# Altium schematic sheet BSPD.SchDoc
size A4
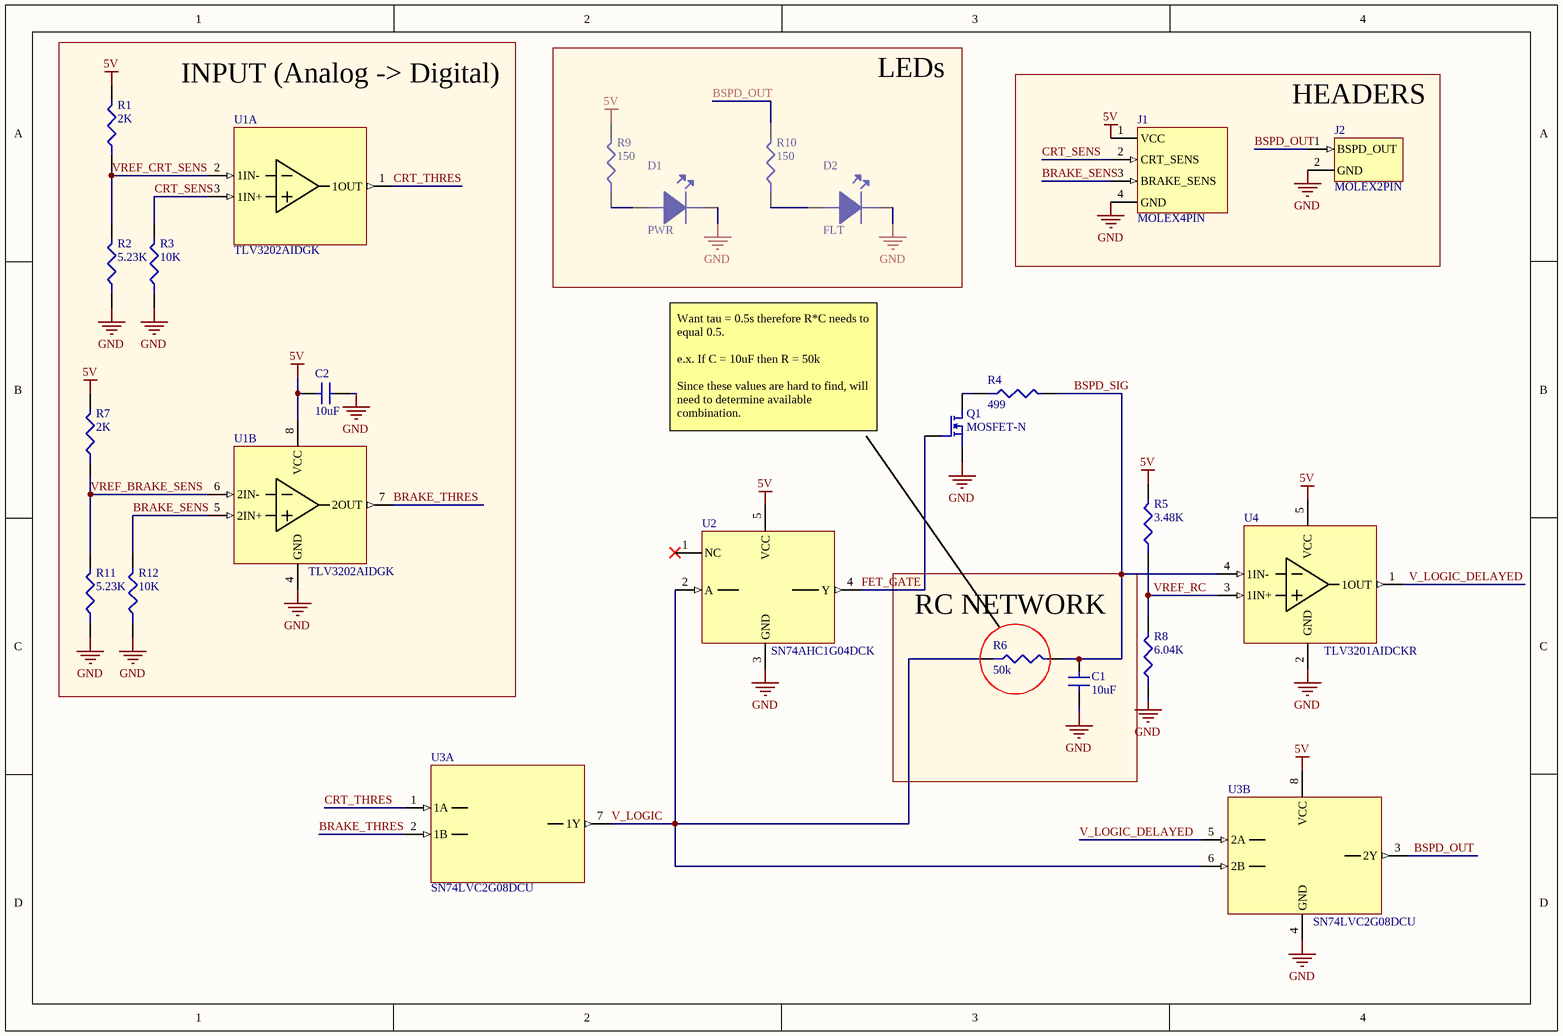
[diagram p0: BSPD.SchDoc]

## Parts
C1  10uF  [C0805]
C2  10uF  [C0805]
D1  PWR  [LED_0603]
D2  FLT  [LED_0603]
J1  MOLEX4PIN  [MOLEX_4PIN]
J2  MOLEX2PIN  [MOLEX_2PIN]
Q1  MOSFET-N  [MOSFET]
R1  2K  [R0805]
R2  5.23K  [R0805]
R3  10K  [R0805]
R4  499  [R0805]
R5  3.48K  [R0805]
R6  50k  [RESC2013X12N]
R7  2K  [R0805]
R8  6.04K  [R0805]
R9  150  [RESC2012X07N]
R10  150  [RESC2012X07N]
R11  5.23K  [R0805]
R12  10K  [R0805]
U1  TLV3202AIDGK  [TLV3202AIDGK]  (parts A,B of 2)
U2  SN74AHC1G04DCK  [SN74AHC1G04DCK]
U3  SN74LVC2G08DCU  [SN74LVC2G08DCUR]  (parts A,B of 2)
U4  TLV3201AIDCKR  [TLV3201AIDCK]

## Blocks framed on the sheet
INPUT (Analog -> Digital): C2 R1-R3 R7 R11 R12 U1
LEDs: D1 D2 R9 R10
HEADERS: J1 J2
RC NETWORK: C1 R6

## Nets
5V: C2.2 J1.1(VCC) R1.2 R5.2 R7.2 R9.2 U1.8(VCC) U2.5(VCC) U3.8(VCC) U4.5(VCC)
GND: C1.1 C2.1 D1.2 D2.2 J1.4(GND) J2.2(GND) Q1.2 R2.1 R3.1 R8.1 R11.1 R12.1 U1.4(GND) U2.3(GND) U3.4(GND) U4.2(GND)
BRAKE_SENS: J1.3(BRAKE_SENS) R12.2 U1.5(2IN+)
BRAKE_THRES: U1.7(2OUT) U3.2(1B)
BSPD_OUT: J2.1(BSPD_OUT) R10.2 U3.3(2Y)
BSPD_SIG: C1.2 R4.2 R6.2 U4.4(1IN-)
CRT_SENS: J1.2(CRT_SENS) R3.2 U1.3(1IN+)
CRT_THRES: U1.1(1OUT) U3.1(1A)
FET_GATE: Q1.1 U2.4(Y)
V_LOGIC: R6.1 U2.2(A) U3.6(2B) U3.7(1Y)
V_LOGIC_DELAYED: U3.5(2A) U4.1(1OUT)
VREF_BRAKE_SENS: R7.1 R11.2 U1.6(2IN-)
VREF_CRT_SENS: R1.1 R2.2 U1.2(1IN-)
VREF_RC: R5.1 R8.2 U4.3(1IN+)
NetD1_1: D1.1 R9.1
NetD2_1: D2.1 R10.1
NetQ1_3: Q1.3 R4.1

Not connected (* = marked no-connect by the designer): U2 1(NC)*

## Notes on the sheet
- Want tau = 0.5s therefore R*C needs to equal 0.5.
  e.x. If C = 10uF then R = 50k
  Since these values are hard to find, will need to determine available combination.

## Library data of the parts
C1 C2 = CL21A106KPFNNNG: Cap Ceramic 10uF 10V X5R 10% SMD 0805 85C Embossed T/R; Manufacturer: Samsung; Supplier 1: Digi-Key; Manufacturer Part Number: CL21A106KPFNNNG; Stock 1: 0; Pricing 1: 1=0.15, 10=0.104, 100=0.0489, 500=0.03428, 1000=0.02837 (USD); Mount: Surface Mount; Case/Package: 0805; Case Code (Metric): 2012; Case Code (Imperial): 0805; Min Operating Temperature: -55°C; Max Operating Temperature: 85°C; Capacitance: 10uF; Tolerance: 10%; Dielectric: X5R; Voltage: 10V; Voltage Rating: 10V; Packaging: Tape and Reel; Package Quantity: 3000; Termination: Wraparound; Length: 2mm; Height: 1.25mm; Depth: 1.25mm; Width: 0.049inch; Thickness: 0.053inch; Radiation Hardening: No; Lead Free: Lead Free; ComponentLink1URL: http://www1.futureelectronics.com/doc/SAMSUNG/CL21A106KPFNNNG.pdf?src-supplier=Future+Electronics; ComponentLink1Description: http://www1.futureelectronics.com/doc/SAMSUNG/CL21A106KPFNNNG.pdf?src-supplier=Future+Electronics; ComponentLink2URL: https://www.verical.com/server-webapp/html/getDatasheet?partID=640497&src-supplier=Verical; ComponentLink2Description: https://www.verical.com/server-webapp/html/getDatasheet?partID=640497&src-supplier=Verical; Supplier Part Number 1: 1276-6456-1-ND
D1 = LTST-C191KGKT: LED GREEN CLEAR SMD; Manufacturer: Vishay Lite-On; Lens Color: Colorless; Power Rating: 75mW; Luminous Intensity: 35mcd; Viewing Angle: 130°; Lens Style: Diffused,Colorless,Rectangular,Clear; Forward Current: 30mA; Forward Voltage: 2V; Dominant Wavelength: 571nm; Test Current: 20mA; Number of Elements: 1; Wavelength: 574nm; Reverse Voltage: 5V; Supplier 1: Digi-Key; Manufacturer Part Number: LTST-C191KGKT; Stock 1: 1356717; Pricing 1: 1=0.29, 10=0.211, 25=0.1556, 100=0.1111, 250=0.07556, 500=0.06666, 1000=0.05222, 2500=0.05111 (USD); Mount: Surface Mount; Case/Package: 0603; Number of Pins: 2; Color: Green; Case Code (Metric): 1608; Case Code (Imperial): 0603; Min Operating Temperature: -55°C; Max Operating Temperature: 85°C; Packaging: Tape and Reel; Package Quantity: 1; Illumination Color: Green; Lens Transparency: Clear; Power Dissipation: 75mW; Number of LEDs: 1; Length: 1.6mm; Height: 0.55mm; Width: 0.8mm; Depth: 0.8mm; Radiation Hardening: No; Lead Free: Lead Free; ComponentLink1URL: http://www.mouser.com/ds/2/239/LTST-C191KGKT-1141954.pdf?src-supplier=Mouser; ComponentLink1Description: http://www.mouser.com/ds/2/239/LTST-C191KGKT-1141954.pdf?src-supplier=Mouser; ComponentLink2URL: http://optoelectronics.liteon.com/upload/download/DS22-2000-228/LTST-C191KGKT.PDF?src-supplier=Digi-Key; ComponentLink2Description: http://optoelectronics.liteon.com/upload/download/DS22-2000-228/LTST-C191KGKT.PDF?src-supplier=Digi-Key; ComponentLink3URL: https://www.verical.com/server-webapp/html/getDatasheet?partID=103913&src-supplier=Verical; ComponentLink3Description: https://www.verical.com/server-webapp/html/getDatasheet?partID=103913&src-supplier=Verical; ComponentLink4URL: http://uk.rs-online.com/webdocs/0dc0/0900766b80dc02b1.pdf?src-supplier=RSComponents; ComponentLink4Description: http://uk.rs-online.com/webdocs/0dc0/0900766b80dc02b1.pdf?src-supplier=RSComponents; ComponentLink5URL: http://www1.futureelectronics.com/doc/LITE-ON/LTST-C191KGKT.pdf?src-supplier=Future+Electronics; ComponentLink5Description: http://www1.futureelectronics.com/doc/LITE-ON/LTST-C191KGKT.pdf?src-supplier=Future+Electronics; Supplier Part Number 1: 160-1446-1-ND
D2 = LTST-C191KRKT: LED RED CLEAR SMD; Manufacturer: Vishay Lite-On; Lens Color: Colorless; Power Rating: 75mW; Luminous Intensity: 54mcd; Viewing Angle: 130°; Forward Voltage: 2V; Lens Style: Clear,Diffused,Colorless,Rectangular; Forward Current: 30mA; Dominant Wavelength: 631nm; Test Current: 20mA; Number of Elements: 1; Wavelength: 639nm; Reverse Voltage: 5V; Supplier 1: Digi-Key; Manufacturer Part Number: LTST-C191KRKT; Stock 1: 1012880; Pricing 1: 1=0.29, 10=0.211, 25=0.1556, 100=0.1111, 250=0.07556, 500=0.06666, 1000=0.05222, 2500=0.05111 (USD); Mount: Surface Mount; Case/Package: 0603; Number of Pins: 2; Color: Red; Case Code (Metric): 1608; Case Code (Imperial): 0603; Min Operating Temperature: -55°C; Max Operating Temperature: 85°C; Packaging: Tape and Reel; Package Quantity: 1; Illumination Color: Red; Lens Transparency: Clear; Power Dissipation: 75mW; Number of LEDs: 1; Voltage: 2V; Length: 1.6mm; Height: 0.55mm; Width: 0.8mm; Depth: 0.8mm; Radiation Hardening: No; Lead Free: Lead Free; ComponentLink1URL: http://optoelectronics.liteon.com/upload/download/DS22-2000-223/LTST-C191KRKT.PDF?src-supplier=Digi-Key; ComponentLink1Description: http://optoelectronics.liteon.com/upload/download/DS22-2000-223/LTST-C191KRKT.PDF?src-supplier=Digi-Key; ComponentLink2URL: http://www1.futureelectronics.com/doc/LITE-ON/LTST-C191KRKT.pdf?src-supplier=Future+Electronics; ComponentLink2Description: http://www1.futureelectronics.com/doc/LITE-ON/LTST-C191KRKT.pdf?src-supplier=Future+Electronics; ComponentLink3URL: https://www.verical.com/server-webapp/html/getDatasheet?partID=141922&src-supplier=Verical; ComponentLink3Description: https://www.verical.com/server-webapp/html/getDatasheet?partID=141922&src-supplier=Verical; ComponentLink4URL: http://www.mouser.com/ds/2/239/LTST-C191KRKT-1140668.pdf?src-supplier=Mouser; ComponentLink4Description: http://www.mouser.com/ds/2/239/LTST-C191KRKT-1140668.pdf?src-supplier=Mouser; Supplier Part Number 1: 160-1447-1-ND
J1 = 43650-0400: MOLEX         43650-0400             Wire-To-Board Connector, Micro-Fit 3.0 43650 Series, Solder, Header, 4 Contacts, 3 mm; Connector Type: Plug,Socket; Number of Positions: 4; Current Rating: 5A; Voltage Rating: 600V; Contact Resistance: 10mR; Gender: Male; Voltage Rating (DC): 250V; Pitch: 3mm; Glow Wire Compliant: Compliant; Supplier 1: Digi-Key; Manufacturer: Molex; Manufacturer Part Number: 43650-0400; Stock 1: 1256; Pricing 1: 1=1.36, 10=1.23, 100=1.054, 500=0.87832, 2380=0.72776, 7140=0.66753, 11900=0.65247 (USD); Mount: Cable,Through Hole; Contact Material: Brass,Copper Alloy; Contact Plating: Bright,Tin; Colour: Black; Housing Material: Thermoplastic; Housing Colour: Black; Min Operating Temperature: -40°C; Max Operating Temperature: 105°C; Number of Rows: 1; Packaging: Tray; Termination: Solder; Number of Contacts: 4; Orientation: Right Angle; Package Quantity: 2380; Max Voltage Rating (AC): 600V; Number of Circuits: 4; Length: 14.86mm; Height: 4.5mm; Depth: 3.6mm; Radiation Hardening: No; REACH SVHC: Unknown; Halogen Free: Low Halogen; Lead Free: Contains Lead; Flammability Rating: UL94 V-0; ComponentLink1URL: http://uk.rs-online.com/webdocs/1362/0900766b81362fcc.pdf; ComponentLink1Description: http://uk.rs-online.com/webdocs/1362/0900766b81362fcc.pdf; ComponentLink2URL: http://www.molex.com/webdocs/datasheets/pdf/en-us/0436500400_PCB_HEADERS.pdf; ComponentLink2Description: http://www.molex.com/webdocs/datasheets/pdf/en-us/0436500400_PCB_HEADERS.pdf; ComponentLink3URL: https://www.alliedelec.com/m/d/479cb0864148560b2cdf92342e899bdb.pdf; ComponentLink3Description: https://www.alliedelec.com/m/d/479cb0864148560b2cdf92342e899bdb.pdf; ComponentLink4URL: http://www.onlinecomponents.com/productFiles/mf-MOL/0436500400_pcb_headers.pdf; ComponentLink4Description: http://www.onlinecomponents.com/productFiles/mf-MOL/0436500400_pcb_headers.pdf; ComponentLink5URL: http://www.mouser.com/ds/2/276/0436500400_PCB_HEADERS-148663.pdf; ComponentLink5Description: http://www.mouser.com/ds/2/276/0436500400_PCB_HEADERS-148663.pdf; ComponentLink6URL: http://www.jameco.com/Jameco/Products/ProdDS/884184.pdf; ComponentLink6Description: http://www.jameco.com/Jameco/Products/ProdDS/884184.pdf; Supplier Part Number 1: WM1862-ND
J2 = 43650-0200: Headers & Wire Housings R/A HEADER 2 POS TIN SINGLE ROW; Manufacturer: Molex; Contact Resistance: 10mR; Number of Positions: 2; Connector Type: Plug,Socket; Current Rating: 5A; Voltage Rating (AC): 250V; Voltage Rating: 600V; Gender: Male; Insulation Resistance: 1GR; Pitch: 3mm; Glow Wire Compliant: Compliant; Supplier 1: Digi-Key; Manufacturer Part Number: 43650-0200; Stock 1: 33161; Pricing 1: 1=0.96, 10=0.841, 100=0.7256, 500=0.59364, 3927=0.47821, 7854=0.46172, 11781=0.43863 (USD); Mount: Through Hole; Contact Plating: Tin; Contact Material: Brass,Tin; Colour: Black; Housing Colour: Black; Housing Material: Thermoplastic; Min Operating Temperature: -40°C; Max Operating Temperature: 105°C; Number of Rows: 1; Packaging: Tray; Termination: Solder; Number of Contacts: 2; Orientation: Right Angle; Package Quantity: 3927; Working Voltage: 250V; Number of Circuits: 2; Voltage Rating (DC): 250V; Length: 9.65mm; Height: 5.57mm; Depth: 9.9mm; Radiation Hardening: No; Flammability Rating: UL94 V-0; REACH SVHC: Unknown; Halogen Free: Low Halogen; Lead Free: Lead Free; ComponentLink1URL: http://www.molex.com/webdocs/datasheets/pdf/en-us/0436500200_PCB_HEADERS.pdf; ComponentLink1Description: http://www.molex.com/webdocs/datasheets/pdf/en-us/0436500200_PCB_HEADERS.pdf; ComponentLink2URL: http://www.onlinecomponents.com/productFiles/mf-MOL/1029720436500200_pcb_headers.pdf; ComponentLink2Description: http://www.onlinecomponents.com/productFiles/mf-MOL/1029720436500200_pcb_headers.pdf; ComponentLink3URL: http://www.farnell.com/datasheets/1933359.pdf; ComponentLink3Description: http://www.farnell.com/datasheets/1933359.pdf; ComponentLink4URL: https://www.distrelec.biz/Web/Downloads/20/66/04402066.pdf?mime=application%2Fpdf; ComponentLink4Description: https://www.distrelec.biz/Web/Downloads/20/66/04402066.pdf?mime=application%2Fpdf; ComponentLink5URL: http://www.jameco.com/Jameco/Products/ProdDS/884053.pdf; ComponentLink5Description: http://www.jameco.com/Jameco/Products/ProdDS/884053.pdf; ComponentLink6URL: http://www.mouser.com/ds/2/276/0436500200_PCB_HEADERS-148844.pdf; ComponentLink6Description: http://www.mouser.com/ds/2/276/0436500200_PCB_HEADERS-148844.pdf; ComponentLink7URL: http://uk.rs-online.com/webdocs/13c3/0900766b813c3b7d.pdf; ComponentLink7Description: http://uk.rs-online.com/webdocs/13c3/0900766b813c3b7d.pdf; ComponentLink8URL: http://www.farnell.com/datasheets/1709823.pdf; ComponentLink8Description: http://www.farnell.com/datasheets/1709823.pdf; Supplier Part Number 1: WM1860-ND
Q1 = BSS138LT3G: MOSFET N-CH 50V 200MA SOT-23; Manufacturer: ON Semiconductor; Nominal Vgs: 500mV; Input Capacitance: 50pF; Number of Elements: 1; Max Power Dissipation: 225mW; Rds On Max: 3.5R; Turn-Off Delay Time: 20ns; Element Configuration: Single; Gate to Source Voltage (Vgs): 20V; Supplier 1: Digi-Key; Manufacturer Part Number: BSS138LT3G; Stock 1: 195647; Pricing 1: 1=0.45, 10=0.408, 100=0.2284, 500=0.12234, 1000=0.0832 (USD); Case/Package: SOT-23-3; Number of Pins: 3; Min Operating Temperature: -55°C; Max Operating Temperature: 150°C; Package Quantity: 1; Packaging: Tape and Reel; Drain to Source Voltage (Vdss): 50V; Continuous Drain Current (ID): 200mA; Drain to Source Breakdown Voltage: 50V; Power Dissipation: 225mW; Drain to Source Resistance: 3.5R; Threshold Voltage: 500mV; Turn-On Delay Time: 20ns; Voltage Rating (DC): 50V; Current Rating: 200mA; On-State Resistance: 3.5R; Length: 2.9mm; Height: 0.94mm; Width: 1.3mm; Radiation Hardening: No; REACH SVHC: No SVHC; Lead Free: Lead Free; Halogen Free: Halogen Free; Supplier Part Number 1: BSS138LT3GOSCT-ND; ComponentLink1Description: DigiKey; ComponentLink1URL: https://www.digikey.ca/product-detail/en/BSS138LT3G/BSS138LT3GOSCT-ND/2120566/?itemSeq=274498102
R1 R7 = ERA6AEB202V: RES SMD 2K OHM 0.1% 1/8W 0805; Manufacturer: Panasonic; Resistance: 2kR; Power Rating: 125mW; Voltage Rating: 100V; Temperature Coefficient: 25ppm/°C; Supplier 1: Digi-Key; Manufacturer Part Number: ERA6AEB202V; Stock 1: 110386; Pricing 1: 1=0.36, 10=0.302, 100=0.1182, 1000=0.04948, 2500=0.04536 (USD); Mount: Surface Mount; Case/Package: 0805; Number of Pins: 2; Case Code (Metric): 2012; Case Code (Imperial): 0805; Contact Plating: Tin; Min Operating Temperature: -55°C; Max Operating Temperature: 155°C; Tolerance: 0.1%; Packaging: Tape and Reel; Package Quantity: 1; Composition: Thin Film; Termination: SMD/SMT; Number of Terminations: 2; Military Standard: Not; Max Power Dissipation: 125mW; Voltage Rating (DC): 100V; Features: Automotive AEC-Q200; Length: 2mm; Height: 0.5mm; Width: 1.25mm; Depth: 1.25mm; Radiation Hardening: No; REACH SVHC: No SVHC; Lead Free: Lead Free; ComponentLink1URL: http://industrial.panasonic.com/www-data/pdf/AOA0000/AOA0000CE26.pdf?src-supplier=Future+Electronics; ComponentLink1Description: http://industrial.panasonic.com/www-data/pdf/AOA0000/AOA0000CE26.pdf?src-supplier=Future+Electronics; ComponentLink2URL: http://industrial.panasonic.com/www-data/pdf/AOA0000/AOA0000CE26.pdf?src-supplier=Avnet+Europe; ComponentLink2Description: http://industrial.panasonic.com/www-data/pdf/AOA0000/AOA0000CE26.pdf?src-supplier=Avnet+Europe; ComponentLink3URL: https://www.alliedelec.com/m/d/b6b0537e86f421aa7f5975bb1d8f429a.pdf?src-supplier=Allied+Electronics; ComponentLink3Description: https://www.alliedelec.com/m/d/b6b0537e86f421aa7f5975bb1d8f429a.pdf?src-supplier=Allied+Electronics; ComponentLink4URL: http://www.farnell.com/datasheets/485442.pdf?src-supplier=Element14; ComponentLink4Description: http://www.farnell.com/datasheets/485442.pdf?src-supplier=Element14; ComponentLink5URL: http://www.farnell.com/datasheets/1776116.pdf?src-supplier=Element14; ComponentLink5Description: http://www.farnell.com/datasheets/1776116.pdf?src-supplier=Element14; ComponentLink6URL: https://www.distrelec.biz/Web/Downloads/_t/ds/ERA_eng_tds.pdf?mime=application%2Fpdf&src-supplier=Distrelec; ComponentLink6Description: https://www.distrelec.biz/Web/Downloads/_t/ds/ERA_eng_tds.pdf?mime=application%2Fpdf&src-supplier=Distrelec; ComponentLink7URL: http://www.farnell.com/datasheets/2052875.pdf?src-supplier=Farnell; ComponentLink7Description: http://www.farnell.com/datasheets/2052875.pdf?src-supplier=Farnell; ComponentLink8URL: http://www.farnell.com/datasheets/2059650.pdf?src-supplier=Farnell; ComponentLink8Description: http://www.farnell.com/datasheets/2059650.pdf?src-supplier=Farnell; ComponentLink9URL: http://industrial.panasonic.com/www-data/pdf/AOA0000/AOA0000CE26.pdf?src-supplier=Avnet; ComponentLink9Description: http://industrial.panasonic.com/www-data/pdf/AOA0000/AOA0000CE26.pdf?src-supplier=Avnet; ComponentLink10URL: https://produktinfo.conrad.com/datenblaetter/450000-474999/453123-da-01-en-WIDERSTAND_0805_ERA.pdf?src-supplier=Conrad; ComponentLink10Description: https://produktinfo.conrad.com/datenblaetter/450000-474999/453123-da-01-en-WIDERSTAND_0805_ERA.pdf?src-supplier=Conrad; Supplier Part Number 1: P2.0KDACT-ND
R2 R11 = ERA6AEB5231V: RES SMD 5.23K OHM 0.1% 1/8W 0805; Manufacturer: Panasonic; Resistance: 5.23kR; Temperature Coefficient: 25ppm/°C; Max Power Dissipation: 125mW; Voltage Rating: 100V; Supplier 1: Digi-Key; Manufacturer Part Number: ERA6AEB5231V; Stock 1: 15465; Pricing 1: 1=0.36, 10=0.302, 100=0.1182, 1000=0.04948, 2500=0.04536 (USD); Mount: Surface Mount; Case/Package: 0805; Number of Pins: 2; Case Code (Imperial): 0805; Case Code (Metric): 2012; Contact Plating: Tin; Min Operating Temperature: -55°C; Max Operating Temperature: 155°C; Tolerance: 0.1%; Packaging: Tape and Reel; Composition: Metal Film,Thin Film; Number of Terminations: 2; Features: Automotive AEC-Q200; Power Rating: 125mW; Package Quantity: 1; Termination: SMD/SMT; Voltage Rating (DC): 100V; Military Standard: Not; Length: 2mm; Height: 0.5mm; Width: 1.25mm; Depth: 1.25mm; Radiation Hardening: No; Lead Free: Lead Free; REACH SVHC: No SVHC; ComponentLink1URL: http://uk.rs-online.com/webdocs/0eb1/0900766b80eb1d8c.pdf?src-supplier=RSComponents; ComponentLink1Description: http://uk.rs-online.com/webdocs/0eb1/0900766b80eb1d8c.pdf?src-supplier=RSComponents; ComponentLink2URL: http://www.farnell.com/datasheets/485442.pdf?src-supplier=Element14; ComponentLink2Description: http://www.farnell.com/datasheets/485442.pdf?src-supplier=Element14; ComponentLink3URL: http://www.farnell.com/datasheets/485442.pdf?src-supplier=Farnell; ComponentLink3Description: http://www.farnell.com/datasheets/485442.pdf?src-supplier=Farnell; ComponentLink4URL: http://industrial.panasonic.com/www-data/pdf/AOA0000/AOA0000CE26.pdf?src-supplier=Avnet+Europe; ComponentLink4Description: http://industrial.panasonic.com/www-data/pdf/AOA0000/AOA0000CE26.pdf?src-supplier=Avnet+Europe; ComponentLink5URL: http://industrial.panasonic.com/www-data/pdf/AOA0000/AOA0000CE26.pdf?src-supplier=Avnet; ComponentLink5Description: http://industrial.panasonic.com/www-data/pdf/AOA0000/AOA0000CE26.pdf?src-supplier=Avnet; ComponentLink6URL: http://www.produktinfo.conrad.com/datenblaetter/1100000-1199999/001181288-da-01-en-WIDERSTAND_ERA_0805_5K23_0_1__5000ST.pdf?src-supplier=Conrad; ComponentLink6Description: http://www.produktinfo.conrad.com/datenblaetter/1100000-1199999/001181288-da-01-en-WIDERSTAND_ERA_0805_5K23_0_1__5000ST.pdf?src-supplier=Conrad; Supplier Part Number 1: P5.23KDACT-ND
R3 R12 = ERA6AEB103V: RES SMD 10K OHM 0.1% 1/8W 0805; Manufacturer: Panasonic; Voltage Rating: 100V; Resistance: 10kR; Power Rating: 125mW; Temperature Coefficient: 25ppm/°C; Supplier 1: Digi-Key; Manufacturer Part Number: ERA6AEB103V; Stock 1: 677238; Pricing 1: 1=0.36, 10=0.302, 100=0.1182, 1000=0.04948, 2500=0.04536 (USD); Mount: Surface Mount; Case/Package: 0805; Number of Pins: 2; Case Code (Metric): 2012; Case Code (Imperial): 0805; Contact Plating: Tin; Min Operating Temperature: -55°C; Max Operating Temperature: 155°C; Packaging: Tape and Reel; Tolerance: 0.1%; Package Quantity: 5000; Composition: Metal Film,Thin Film; Number of Terminations: 2; Termination: SMD/SMT; Military Standard: Not; Max Power Dissipation: 125mW; Working Voltage: 100V; Voltage Rating (DC): 100V; Length: 2mm; Height: 0.5mm; Width: 1.25mm; Depth: 1.25mm; Radiation Hardening: No; REACH SVHC: No SVHC; Lead Free: Lead Free; ComponentLink1URL: http://uk.rs-online.com/webdocs/0bee/0900766b80beefcc.pdf?src-supplier=RSComponents; ComponentLink1Description: http://uk.rs-online.com/webdocs/0bee/0900766b80beefcc.pdf?src-supplier=RSComponents; ComponentLink2URL: http://www.farnell.com/datasheets/2052875.pdf?src-supplier=Farnell; ComponentLink2Description: http://www.farnell.com/datasheets/2052875.pdf?src-supplier=Farnell; ComponentLink3URL: http://www.farnell.com/datasheets/485442.pdf?src-supplier=Element14; ComponentLink3Description: http://www.farnell.com/datasheets/485442.pdf?src-supplier=Element14; ComponentLink4URL: http://www.mouser.com/ds/2/315/AOA0000CE26-197354.pdf?src-supplier=Mouser; ComponentLink4Description: http://www.mouser.com/ds/2/315/AOA0000CE26-197354.pdf?src-supplier=Mouser; ComponentLink5URL: https://www.distrelec.biz/Web/Downloads/_t/ds/ERA_eng_tds.pdf?mime=application%2Fpdf&src-supplier=Distrelec; ComponentLink5Description: https://www.distrelec.biz/Web/Downloads/_t/ds/ERA_eng_tds.pdf?mime=application%2Fpdf&src-supplier=Distrelec; ComponentLink6URL: http://industrial.panasonic.com/www-data/pdf/AOA0000/AOA0000CE26.pdf?src-supplier=Avnet; ComponentLink6Description: http://industrial.panasonic.com/www-data/pdf/AOA0000/AOA0000CE26.pdf?src-supplier=Avnet; ComponentLink7URL: https://industrial.panasonic.com/cdbs/www-data/pdf/RDM0000/AOA0000C307.pdf?src-supplier=Future+Electronics; ComponentLink7Description: https://industrial.panasonic.com/cdbs/www-data/pdf/RDM0000/AOA0000C307.pdf?src-supplier=Future+Electronics; ComponentLink8URL: http://www.alliedelec.com/m/d/b6b0537e86f421aa7f5975bb1d8f429a.pdf?src-supplier=Allied+Electronics; ComponentLink8Description: http://www.alliedelec.com/m/d/b6b0537e86f421aa7f5975bb1d8f429a.pdf?src-supplier=Allied+Electronics; ComponentLink9URL: http://www.farnell.com/datasheets/2059650.pdf?src-supplier=Element14; ComponentLink9Description: http://www.farnell.com/datasheets/2059650.pdf?src-supplier=Element14; ComponentLink10URL: http://www.farnell.com/datasheets/485442.pdf?src-supplier=Farnell; ComponentLink10Description: http://www.farnell.com/datasheets/485442.pdf?src-supplier=Farnell; ComponentLink11URL: http://www.produktinfo.conrad.com/datenblaetter/450000-474999/453339-da-01-en-WIDERSTAND_0805_ERA.pdf?src-supplier=Conrad; ComponentLink11Description: http://www.produktinfo.conrad.com/datenblaetter/450000-474999/453339-da-01-en-WIDERSTAND_0805_ERA.pdf?src-supplier=Conrad; Supplier Part Number 1: P10KDACT-ND
R4 = ERA-6AEB4990V: RES SMD 499 OHM 0.1% 1/8W 0805; Manufacturer: Panasonic; Resistance: 499R; Power Rating: 125mW; Voltage Rating: 200V; Temperature Coefficient: 25ppm/°C; Voltage Rating (DC): 100V; Supplier 1: Digi-Key; Manufacturer Part Number: ERA-6AEB4990V; Stock 1: 110604; Pricing 1: 1=0.36, 10=0.302, 100=0.1182, 1000=0.04948, 2500=0.04536 (USD); Mount: Surface Mount; Case/Package: 0805; Number of Pins: 2; Case Code (Imperial): 0805; Case Code (Metric): 2012; Contact Plating: Tin; Min Operating Temperature: -55°C; Max Operating Temperature: 155°C; Tolerance: 0.1%; Packaging: Tape and Reel; Package Quantity: 5000; Termination: SMD/SMT; Composition: Metal Film,Thin Film; Number of Terminations: 2; Military Standard: Not; Max Power Dissipation: 125mW; Working Voltage: 100V; Length: 2mm; Height: 0.5mm; Width: 1.25mm; Depth: 1.25mm; Radiation Hardening: No; Lead Free: Lead Free; REACH SVHC: No SVHC; ComponentLink1URL: http://uk.rs-online.com/webdocs/0eb1/0900766b80eb1d8c.pdf?src-supplier=RSComponents; ComponentLink1Description: http://uk.rs-online.com/webdocs/0eb1/0900766b80eb1d8c.pdf?src-supplier=RSComponents; ComponentLink2URL: http://www.farnell.com/datasheets/485442.pdf?src-supplier=Farnell; ComponentLink2Description: http://www.farnell.com/datasheets/485442.pdf?src-supplier=Farnell; ComponentLink3URL: http://www.farnell.com/datasheets/2052875.pdf?src-supplier=Farnell; ComponentLink3Description: http://www.farnell.com/datasheets/2052875.pdf?src-supplier=Farnell; ComponentLink4URL: http://industrial.panasonic.com/www-data/pdf/AOA0000/AOA0000CE26.pdf?src-supplier=Avnet+Europe; ComponentLink4Description: http://industrial.panasonic.com/www-data/pdf/AOA0000/AOA0000CE26.pdf?src-supplier=Avnet+Europe; ComponentLink5URL: http://www.farnell.com/datasheets/485442.pdf?src-supplier=Element14; ComponentLink5Description: http://www.farnell.com/datasheets/485442.pdf?src-supplier=Element14; ComponentLink6URL: http://industrial.panasonic.com/www-data/pdf/AOA0000/AOA0000CE26.pdf?src-supplier=Avnet; ComponentLink6Description: http://industrial.panasonic.com/www-data/pdf/AOA0000/AOA0000CE26.pdf?src-supplier=Avnet; ComponentLink7URL: https://produktinfo.conrad.com/datenblaetter/450000-474999/459335-da-01-en-WIDERSTAND_0805_ERA.pdf?src-supplier=Conrad; ComponentLink7Description: https://produktinfo.conrad.com/datenblaetter/450000-474999/459335-da-01-en-WIDERSTAND_0805_ERA.pdf?src-supplier=Conrad; Supplier Part Number 1: P499DACT-ND
R5 = ERA6AEB3483V: RES SMD 348K OHM 0.1% 1/8W 0805; Manufacturer: Panasonic; Resistance: 348kR; Power Rating: 125mW; Voltage Rating: 100V; Temperature Coefficient: 25ppm/°C; Supplier 1: Digi-Key; Manufacturer Part Number: ERA6AEB3483V; Stock 1: 10948; Pricing 1: 1=0.36, 10=0.302, 100=0.1182, 1000=0.04948, 2500=0.04536 (USD); Mount: Surface Mount; Case/Package: 0805; Number of Pins: 2; Weight: 0.000194oz; Case Code (Imperial): 0805; Case Code (Metric): 2012; Contact Plating: Tin; Min Operating Temperature: -55°C; Max Operating Temperature: 155°C; Tolerance: 0.1%; Packaging: Tape and Reel; Package Quantity: 1; Composition: Metal Film,Thin Film; Termination: SMD/SMT; Number of Terminations: 2; Max Power Dissipation: 125mW; Voltage Rating (DC): 100V; Features: Automotive AEC-Q200; Military Standard: Not; Length: 2mm; Height: 0.5mm; Width: 1.25mm; Depth: 1.25mm; Radiation Hardening: No; Lead Free: Lead Free; ComponentLink1URL: http://www.farnell.com/datasheets/485442.pdf?src-supplier=Element14; ComponentLink1Description: http://www.farnell.com/datasheets/485442.pdf?src-supplier=Element14; ComponentLink2URL: http://www.farnell.com/datasheets/485442.pdf?src-supplier=Farnell; ComponentLink2Description: http://www.farnell.com/datasheets/485442.pdf?src-supplier=Farnell; ComponentLink3URL: http://uk.rs-online.com/webdocs/0eb1/0900766b80eb1d8c.pdf?src-supplier=RSComponents; ComponentLink3Description: http://uk.rs-online.com/webdocs/0eb1/0900766b80eb1d8c.pdf?src-supplier=RSComponents; ComponentLink4URL: http://www.produktinfo.conrad.com/datenblaetter/1100000-1199999/001181390-da-01-en-WIDERSTAND_ERA_0805_348K_0_1__5000ST.pdf?src-supplier=Conrad; ComponentLink4Description: http://www.produktinfo.conrad.com/datenblaetter/1100000-1199999/001181390-da-01-en-WIDERSTAND_ERA_0805_348K_0_1__5000ST.pdf?src-supplier=Conrad; Supplier Part Number 1: P348KDACT-ND
R6 = PTN0805E5002BST1: RES 50K OHM 0.1% 1/5W 0805; Manufacturer: Vishay; Supplier 1: Digi-Key; Manufacturer Part Number: PTN0805E5002BST1; Stock 1: 3755; Pricing 1: 1=0.78, 10=0.647, 100=0.4343 (USD); Supplier Part Number 1: 764-1535-6-ND; ComponentLink1Description: DigiKey; ComponentLink1URL: https://www.digikey.ca/product-detail/en/PTN0805E5002BST1/764-1535-1-ND/7103319/?itemSeq=274495083
R8 = ERA6AEB6041V: RES SMD 6.04K OHM 0.1% 1/8W 0805; Manufacturer: Panasonic; Resistance: 6.04kR; Temperature Coefficient: 25ppm/°C; Power Rating: 125mW; Voltage Rating: 100V; Supplier 1: Digi-Key; Manufacturer Part Number: ERA6AEB6041V; Stock 1: 15898; Pricing 1: 1=0.36, 10=0.302, 100=0.1182, 1000=0.04948, 2500=0.04536 (USD); Mount: Surface Mount; Case/Package: 0805; Number of Pins: 2; Weight: 0.000194oz; Case Code (Imperial): 0805; Case Code (Metric): 2012; Contact Plating: Tin; Min Operating Temperature: -55°C; Max Operating Temperature: 155°C; Packaging: Tape and Reel; Tolerance: 0.1%; Composition: Metal Film,Thin Film; Termination: SMD/SMT; Number of Terminations: 2; Max Power Dissipation: 125mW; Features: Automotive AEC-Q200; Package Quantity: 1; Voltage Rating (DC): 100V; Length: 2mm; Height: 0.5mm; Width: 1.25mm; Depth: 1.25mm; Radiation Hardening: No; Lead Free: Lead Free; ComponentLink1URL: http://www.mouser.com/ds/2/315/AOA0000C237-1100991.pdf?src-supplier=Mouser; ComponentLink1Description: http://www.mouser.com/ds/2/315/AOA0000C237-1100991.pdf?src-supplier=Mouser; ComponentLink2URL: http://www.farnell.com/datasheets/485442.pdf?src-supplier=Element14; ComponentLink2Description: http://www.farnell.com/datasheets/485442.pdf?src-supplier=Element14; ComponentLink3URL: http://industrial.panasonic.com/www-data/pdf/AOA0000/AOA0000CE26.pdf?src-supplier=Avnet; ComponentLink3Description: http://industrial.panasonic.com/www-data/pdf/AOA0000/AOA0000CE26.pdf?src-supplier=Avnet; ComponentLink4URL: http://www.farnell.com/datasheets/485442.pdf?src-supplier=Farnell; ComponentLink4Description: http://www.farnell.com/datasheets/485442.pdf?src-supplier=Farnell; ComponentLink5URL: http://uk.rs-online.com/webdocs/0eb1/0900766b80eb1d8c.pdf?src-supplier=RSComponents; ComponentLink5Description: http://uk.rs-online.com/webdocs/0eb1/0900766b80eb1d8c.pdf?src-supplier=RSComponents; ComponentLink6URL: http://www.produktinfo.conrad.com/datenblaetter/1100000-1199999/001181293-da-01-en-WIDERSTAND_ERA_0805_6K04_0_1__5000ST.pdf?src-supplier=Conrad; ComponentLink6Description: http://www.produktinfo.conrad.com/datenblaetter/1100000-1199999/001181293-da-01-en-WIDERSTAND_ERA_0805_6K04_0_1__5000ST.pdf?src-supplier=Conrad; Supplier Part Number 1: P6.04KDACT-ND
R9 R10 = ERJ6ENF1500V: RES SMD 150 OHM 1% 1/8W 0805; Manufacturer: Panasonic; Voltage Rating: 150V; Resistance: 150R; Power Rating: 125mW; Temperature Coefficient: 100ppm/°C; Supplier 1: Digi-Key; Manufacturer Part Number: ERJ6ENF1500V; Stock 1: 125951; Pricing 1: 1=0.1, 10=0.081, 100=0.0311, 1000=0.01367, 2500=0.01181 (USD); Mount: Surface Mount; Case/Package: 0805; Number of Pins: 2; Case Code (Metric): 2012; Case Code (Imperial): 0805; Contact Plating: Tin; Min Operating Temperature: -55°C; Max Operating Temperature: 155°C; Packaging: Tape and Reel; Tolerance: 1%; Package Quantity: 1; Composition: Thick Film; Number of Terminations: 2; Military Standard: Not; Termination: SMD/SMT; Max Power Dissipation: 125mW; Voltage Rating (DC): 150V; Features: Automotive AEC-Q200; Working Voltage: 150V; Length: 2mm; Height: 0.6mm; Width: 0.049inch; Depth: 1.25mm; Radiation Hardening: No; REACH SVHC: No SVHC; Lead Free: Lead Free; ComponentLink1URL: http://www.farnell.com/datasheets/426256.pdf?src-supplier=Element14; ComponentLink1Description: http://www.farnell.com/datasheets/426256.pdf?src-supplier=Element14; ComponentLink2URL: https://www.alliedelec.com/m/d/623f45ff1957d936ff56d46fd1c28cac.pdf?src-supplier=Allied+Electronics; ComponentLink2Description: https://www.alliedelec.com/m/d/623f45ff1957d936ff56d46fd1c28cac.pdf?src-supplier=Allied+Electronics; ComponentLink3URL: http://www.farnell.com/datasheets/1678782.pdf?src-supplier=Element14; ComponentLink3Description: http://www.farnell.com/datasheets/1678782.pdf?src-supplier=Element14; ComponentLink4URL: http://industrial.panasonic.com/www-data/pdf/AOA0000/AOA0000CE2.pdf?src-supplier=Avnet; ComponentLink4Description: http://industrial.panasonic.com/www-data/pdf/AOA0000/AOA0000CE2.pdf?src-supplier=Avnet; ComponentLink5URL: http://www.mouser.com/ds/2/315/AOA0000C283-1093288.pdf?src-supplier=Mouser; ComponentLink5Description: http://www.mouser.com/ds/2/315/AOA0000C283-1093288.pdf?src-supplier=Mouser; ComponentLink6URL: http://www.farnell.com/datasheets/426256.pdf?src-supplier=Farnell; ComponentLink6Description: http://www.farnell.com/datasheets/426256.pdf?src-supplier=Farnell; Supplier Part Number 1: P150CCT-ND
U1 = TLV3202AIDGK: IC COMPAR PWR RRI DL PP 8VSSOP; Manufacturer: Texas Instruments; Min Supply Voltage: 2.7V; Max Supply Voltage: 5.5V; Number of Elements: 2; Nominal Supply Current: 50uA; Max Supply Current: 40uA; Input Bias Current: 50pA; Input Offset Voltage (Vos): 5mV; Response Time: 0.047us; Propagation Delay: 50ns; Common Mode Rejection Ratio: 70dB; Hysteresis: 1.2mV; Power Supply Rejection Ratio (PSRR): 85dB; ComponentLink1Description: digikey.ca; ComponentLink1URL: https://www.digikey.ca/product-detail/en/texas-instruments/TLV3202AIDGK/296-34992-ND/3588984; Supplier 1: Digi-Key; Manufacturer Part Number: TLV3202AIDGK; Stock 1: 14534; Pricing 1: 1=1.77, 80=1.5, 160=1.278, 560=1.05, 1040=0.87 (USD); Mount: Surface Mount; Case/Package: VSSOP; Number of Pins: 8; Min Operating Temperature: -40°C; Max Operating Temperature: 125°C; Packaging: Rail/Tube; Package Quantity: 80; Number of Channels: 2; Max Input Current: 50pA; Quiescent Current: 50uA; Type: General Purpose; Length: 3.1mm; Height: 0.95mm; Width: 3.1mm; Radiation Hardening: No; Lead Free: Lead Free; REACH SVHC: No SVHC; ComponentLink2URL: https://datasheet.ciiva.com/12288/tlv3202-193866-12288098.pdf; ComponentLink2Description: https://datasheet.ciiva.com/12288/tlv3202-193866-12288098.pdf; ComponentLink3URL: https://datasheet.ciiva.com/23702/1645741-23702136.pdf; ComponentLink3Description: https://datasheet.ciiva.com/23702/1645741-23702136.pdf; ComponentLink4URL: https://datasheet.ciiva.com/8066/1645741-8066013.pdf; ComponentLink4Description: https://datasheet.ciiva.com/8066/1645741-8066013.pdf; Supplier Part Number 1: 296-34992-ND; Supplier 2: Digi-Key
U2 = SN74AHC1G04DCK: The SN74AHC1G04 contains one inverter gate. The / device performs the Boolean function Y = A bar.; Manufacturer: Texas Instruments; Manufacturer Part Number: SN74AHC1G04DCKR; Output Current: 8mA; Number of Inputs: 1; Min Supply Voltage: 2V; Max Supply Voltage: 5.5V; Logic Function: Buffer,Inverter,Inverting; Propagation Delay: 12ns; Quiescent Current: 1uA; High Level Output Current: -8mA; Turn-On Delay Time: 10.6ns; Schmitt Trigger Input: No; Supplier 1: Digi-Key; ComponentLink1Description: Digi-Key; ComponentLink1URL: https://www.digikey.com/product-detail/en/texas-instruments/SN74AHC1G04DCKR/296-1090-1-ND/276358; Supplier Part Number 1: 296-1090-1-ND; Stock 1: 120362; Pricing 1: 1=0.43, 10=0.32, 100=0.1996, 500=0.13658, 1000=0.10506 (USD); Mount: Surface Mount; Case/Package: SC; Number of Pins: 5; Weight: 8.8E-05oz; Contact Plating: Gold; Min Operating Temperature: -40°C; Max Operating Temperature: 125°C; Max Output Current: 8mA; Number of Elements: 1; Packaging: Tape and Reel; Package Quantity: 1; Number of Circuits: 1; Low Level Output Current: 8mA; Termination: SMD/SMT; Number of Gates: 1; Number of Bits: 1; Length: 2mm; Height: 0.9mm; Width: 1.25mm; Radiation Hardening: No; REACH SVHC: No SVHC; Lead Free: Lead Free; ComponentLink2URL: http://www.farnell.com/datasheets/1759812.pdf?src-supplier=Element14; ComponentLink2Description: http://www.farnell.com/datasheets/1759812.pdf?src-supplier=Element14; ComponentLink3URL: http://www.jameco.com/Jameco/Products/ProdDS/912915.pdf?src-supplier=Jameco; ComponentLink3Description: http://www.jameco.com/Jameco/Products/ProdDS/912915.pdf?src-supplier=Jameco; ComponentLink4URL: http://www.ti.com/lit/ds/symlink/sn74ahc1g04.pdf?src-supplier=Digi-Key; ComponentLink4Description: http://www.ti.com/lit/ds/symlink/sn74ahc1g04.pdf?src-supplier=Digi-Key; ComponentLink5URL: https://www.verical.com/server-webapp/html/getDatasheet?partID=53378&src-supplier=Verical; ComponentLink5Description: https://www.verical.com/server-webapp/html/getDatasheet?partID=53378&src-supplier=Verical; ComponentLink6URL: http://www.farnell.com/datasheets/2024272.pdf?src-supplier=Element14; ComponentLink6Description: http://www.farnell.com/datasheets/2024272.pdf?src-supplier=Element14; ComponentLink7URL: http://www.ti.com/general/docs/lit/getliterature.tsp?genericPartNumber=SN74AHC1G04&amp;&amp;fileType=pdf&src-supplier=Avnet+Asia; ComponentLink7Description: http://www.ti.com/general/docs/lit/getliterature.tsp?genericPartNumber=SN74AHC1G04&amp;&amp;fileType=pdf&src-supplier=Avnet+Asia
U3 = SN74LVC2G08DCUR: Dual 2-Input Positive-AND Gate; Supplier 1: Digi-Key; Supplier Part Number 1: 296-26615-1-ND
U4 = TLV3201AIDCKR: Comparator Single R-R I/P 5.5V 5-Pin SC-70 T/R; Manufacturer: Texas Instruments; Common Mode Rejection Ratio: 85dB; Min Supply Voltage: 2.7V; Number of Elements: 1; Propagation Delay: 50ns; Nominal Supply Current: 50uA; Input Offset Voltage (Vos): 5mV; Input Bias Current: 5nA; Quiescent Current: 40uA; Hysteresis: 1.2mV; Response Time: 0.047us; Supplier 1: Digi-Key; Manufacturer Part Number: TLV3201AIDCKR; Stock 1: 34988; Pricing 1: 1=1.36000, 10=1.21500, 100=0.94760, 500=0.78280, 1000=0.61800 (USD); RoHS: Yes; Mount: Surface Mount; Case/Package: SOT-23-5; Number of Pins: 5; Min Operating Temperature: -40°C; Max Operating Temperature: 125°C; Max Supply Voltage: 5.5V; Packaging: Tape and Reel; Package Quantity: 3000; Max Input Current: 5nA; Max Supply Current: 40uA; Number of Channels: 1; Power Supply Rejection Ratio (PSRR): 85dB; Type: General Purpose; Radiation Hardening: No; Lead Free: Lead Free; ComponentLink1URL: https://datasheet.ciiva.com/29635/tlv3201-29635045.pdf?src-supplier=Digi-Key; ComponentLink1Description: https://datasheet.ciiva.com/29635/tlv3201-29635045.pdf?src-supplier=Digi-Key; ComponentLink2URL: https://datasheet.ciiva.com/2966/tlv3202-2966812.pdf?src-supplier=Avnet; ComponentLink2Description: https://datasheet.ciiva.com/2966/tlv3202-2966812.pdf?src-supplier=Avnet; Supplier Part Number 1: 296-36751-1-ND